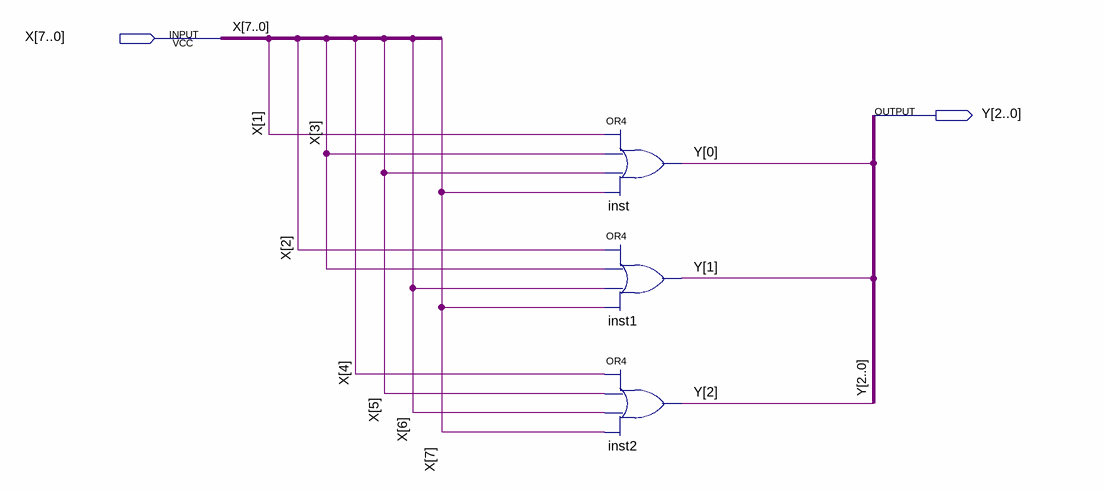
[diagram p0: schematic sheet]
// Quartus schematic encoder8x3.bdf as structural Verilog: 3 symbols, 2 pins
module encoder8x3 (
  input  [7:0] X,
  output [2:0] Y
);

  or inst (Y[0], X[1], X[3], X[5], X[7]);
  or inst1 (Y[1], X[2], X[3], X[6], X[7]);
  or inst2 (Y[2], X[4], X[5], X[6], X[7]);
endmodule
